# Altium project PCB_Project1.PrjPCB
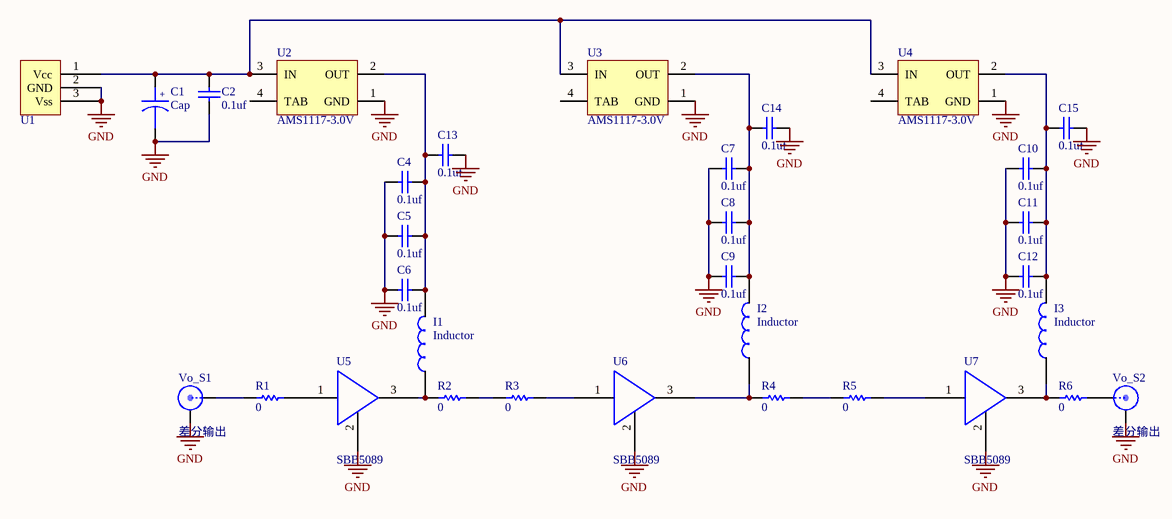
[diagram p0: Sheet1.SchDoc]
1 sheet, 32 parts. Net scope: global (net labels, ports and power ports of the same name join across sheets).
Board file: PCB1.PcbDoc

## Sheet Sheet1.SchDoc
size A4

### Parts
C1  Cap  [3216C-TYPE_A]
C2  0.1uf  [3216C-TYPE_A]
C4  0.1uf  [0603C]
C5  0.1uf  [0603C]
C6  0.1uf  [0603C]
C7  0.1uf  [0603C]
C8  0.1uf  [0603C]
C9  0.1uf  [0603C]
C10  0.1uf  [0603C]
C11  0.1uf  [0603C]
C12  0.1uf  [0603C]
C13  0.1uf  [3216C-TYPE_A]
C14  0.1uf  [3216C-TYPE_A]
C15  0.1uf  [3216C-TYPE_A]
I1  Inductor  [0603R]
I2  Inductor  [0603R]
I3  Inductor  [0603R]
R1  0  [0603R]
R2  0  [0603R]
R3  0  [0603R]
R4  0  [0603R]
R5  0  [0603R]
R6  0  [0603R]
U1  XH2.54-3p  [XH2.54-3p]  (value not drawn)
U2  AMS1117-3.0V  [SOT-223]
U3  AMS1117-3.0V  [SOT-223]
U4  AMS1117-3.0V  [SOT-223]
U5  SBB5089  [SOT-89]
U6  SBB5089  [SOT-89]
U7  SBB5089  [SOT-89]
Vo_S1  差分输出  [SMA Angle]
Vo_S2  差分输出  [SMA Angle]

### Nets
GND: C1.2 C2.1 C4.1 C5.1 C6.1 C7.1 C8.1 C9.1 C10.1 C11.1 C12.1 C13.2 C14.2 C15.2 U1.2(GND) U1.3(Vss) U2.1(GND) U3.1(GND) U4.1(GND) U5.2(GND) U6.2(GND) U7.2(GND) Vo_S1.1 Vo_S2.1
NetC1_1: C1.1 C2.2 U1.1(Vcc) U2.3(IN) U3.3(IN) U4.3(IN)
NetC4_2: C4.2 C5.2 C6.2 C13.1 I1.2 U2.2(OUT)
NetC7_2: C7.2 C8.2 C9.2 C14.1 I2.2 U3.2(OUT)
NetC10_2: C10.2 C11.2 C12.2 C15.1 I3.2 U4.2(OUT)
NetI1_1: I1.1 R2.1 U5.3(OUT)
NetI2_1: I2.1 R4.1 U6.3(OUT)
NetI3_1: I3.1 R6.1 U7.3(OUT)
NetR1_1: R1.1 Vo_S1.0
NetR1_2: R1.2 U5.1(IN)
NetR2_2: R2.2 R3.1
NetR3_2: R3.2 U6.1(IN)
NetR4_2: R4.2 R5.1
NetR5_2: R5.2 U7.1(IN)
NetR6_2: R6.2 Vo_S2.0

Not connected (* = marked no-connect by the designer): U2 4(TAB); U3 4(TAB); U4 4(TAB)

### Notes on the sheet
- (in symbol Tantalium Cap) +
- (in symbol Cap) +

### Library data of the parts
C1 = Tantalium Cap
C2 C4-C15 = Cap
R1-R6 = Res
Vo_S1 Vo_S2 = SMA